# EAGLE design PulsePal_3_0_4 (EAGLE 9.6.2)
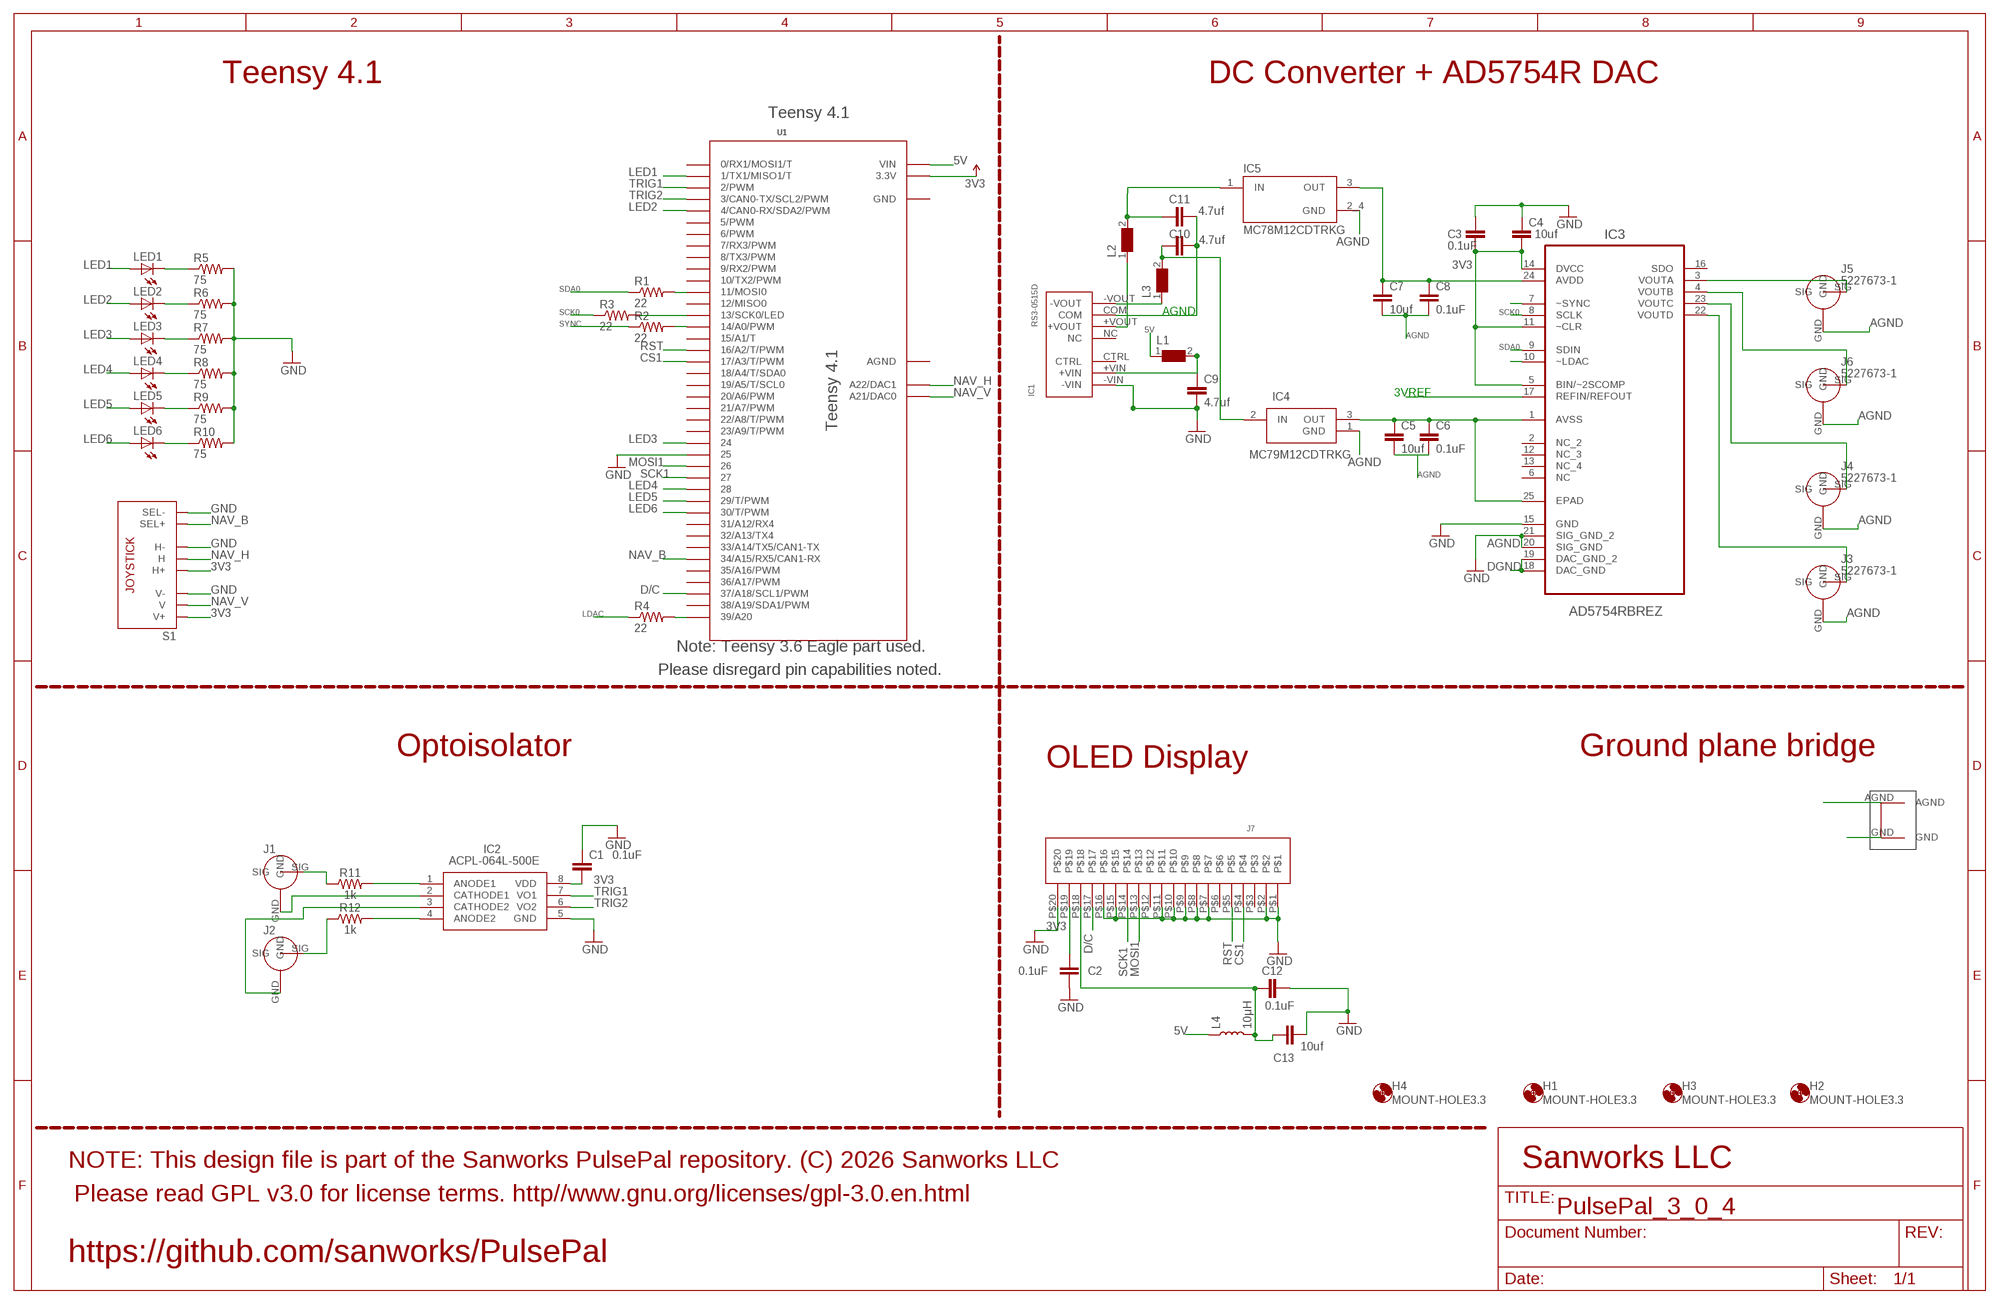
[diagram p0: schematic, sheet 1]

## Parts
C1  0.1uF  1.0UF-0805-25V-10%  [0805]
C2  0.1uF  1.0UF-0805-25V-10%  [0805]
C3  0.1uF  1.0UF-0805-25V-10%  [0805]
C4  10uf  CAP1206  [1206@1]
C5  10uf  CAP1206  [1206@1]
C6  0.1uF  1.0UF-0805-25V-10%  [0805]
C7  10uf  CAP1206  [1206@1]
C8  0.1uF  1.0UF-0805-25V-10%  [0805]
C9  4.7uf  CAP1206  [1206@1]
C10  4.7uf  CAP1206  [1206@1]
C11  4.7uf  CAP1206  [1206@1]
C12  0.1uF  1.0UF-0805-25V-10%  [0805]
C13  10uf  CAP1206  [1206@1]
H1  MOUNT-HOLE3.3  [3,3]
H2  MOUNT-HOLE3.3  [3,3]
H3  MOUNT-HOLE3.3  [3,3]
H4  MOUNT-HOLE3.3  [3,3]
IC1  RS3-0515D  [RS3-0515D]
IC2  ACPL-064L-500E  [SOIC127P599X330-8N]
IC3  AD5754RBREZ  [SOP65P640X120-25N]
IC4  MC79M12CDTRKG  [NVD5117PLT4GVF01]
IC5  MC78M12CDTRKG  [VREG_MC78M12CDTRKG]
J1  5227673-1  [52276731]
J2  5227673-1  [52276731]
J3  5227673-1  [52276731]
J4  5227673-1  [52276731]
J5  5227673-1  [52276731]
J6  5227673-1  [52276731]
J7  NHD-2.7-12864WDW3  [NHD-2.7-12864WDW3]
L1  WE-CBF-742792118_1206  [1206]
L2  WE-CBF-742792118_1206  [1206]
L3  WE-CBF-742792118_1206  [1206]
L4  10μH  2.2μH_SHIELDED_INDUCTOR  [0806]
LED1  LEDCHIPLED_1206  [CHIPLED_1206]
LED2  LEDCHIPLED_1206  [CHIPLED_1206]
LED3  LEDCHIPLED_1206  [CHIPLED_1206]
LED4  LEDCHIPLED_1206  [CHIPLED_1206]
LED5  LEDCHIPLED_1206  [CHIPLED_1206]
LED6  LEDCHIPLED_1206  [CHIPLED_1206]
R1  22  RESISTOR1206  [1206]
R2  22  RESISTOR1206  [1206]
R3  22  RESISTOR1206  [1206]
R4  22  RESISTOR1206  [1206]
R5  75  RESISTOR1206  [1206]
R6  75  RESISTOR1206  [1206]
R7  75  RESISTOR1206  [1206]
R8  75  RESISTOR1206  [1206]
R9  75  RESISTOR1206  [1206]
R10  75  RESISTOR1206  [1206]
R11  1k  10OHM-1206-1/4W-1%  [1206]
R12  1k  10OHM-1206-1/4W-1%  [1206]
S1  JOYSTICKPTH  [JOYSTICK]
U1  TEENSY_3.6_DIL  [TEENSY_3.6_DIL]
U$6  GNDPLANESHRT  [GNDPLANESHRT]

## Nets
3V3: C1.2 C2.1 C3.2 C4.2 IC2.8(VDD) IC3.5(BIN/~2SCOMP) IC3.11(~CLR) IC3.14(DVCC) J7.P$19 S1.H1(H+) S1.V1(V+) U1.3.3V U1.3.3V3(3.3V) ; supply symbol labelled VCC
3VREF: IC3.17(REFIN/REFOUT)
5V: L1.1 L4.1 U1.VIN
AGND: C5.2 C6.2 C7.2 C8.2 C10.1 C11.2 IC1.COM IC3.18(DAC_GND) IC3.19(DAC_GND_2) IC3.20(SIG_GND) IC3.21(SIG_GND_2) IC4.1(GND) IC5.2_4(GND) J3.GND J4.GND J5.GND J6.GND U$6.AGND ; supply symbol labelled GND
CS1: J7.P$4 U1.17/A3(17/A3/T/PWM)
D/C: J7.P$17 U1.37/A18(37/A18/SCL1/PWM)
GND: C1.1 C2.2 C3.1 C4.1 C9.2 C12.2 C13.2 IC1.-VIN IC2.5(GND) IC3.15(GND) J7.P$1 J7.P$2 J7.P$7 J7.P$8 J7.P$9 J7.P$10 J7.P$11 J7.P$15 J7.P$16 J7.P$20 R5.2 R6.2 R7.2 R8.2 R9.2 R10.2 S1.B2A(SEL-) S1.H3(H-) S1.V3(V-) U1.25 U$6.GND
LDAC: IC3.10(~LDAC) R4.1
LED1: LED1.A U1.1(1/TX1/MISO1/T)
LED2: LED2.A U1.4(4/CAN0-RX/SDA2/PWM)
LED3: LED3.A U1.24
LED4: LED4.A U1.28
LED5: LED5.A U1.29(29/T/PWM)
LED6: LED6.A U1.30(30/T/PWM)
MOSI1: J7.P$13 U1.26
N$1: IC2.1(ANODE1) R11.2
N$2: J1.SIG R11.1
N$3: IC2.4(ANODE2) R12.2
N$4: J2.SIG R12.1
N$5: IC2.2(CATHODE1) J1.GND
N$6: IC2.3(CATHODE2) J2.GND
N$7: LED1.C R5.1
N$8: LED2.C R6.1
N$9: IC3.3(VOUTA) J5.SIG
N$10: IC3.4(VOUTB) J6.SIG
N$11: IC3.23(VOUTC) J4.SIG
N$12: IC3.22(VOUTD) J3.SIG
N$13: R1.2 U1.11(11/MOSI0)
N$14: R3.2 U1.13(13/SCK0/LED)
N$15: IC1.-VOUT L3.1
N$16: IC1.+VOUT L2.1
N$17: R2.2 U1.14/A0(14/A0/PWM)
N$18: R4.2 U1.39/A20
N$19: LED3.C R7.1
N$20: LED4.C R8.1
N$21: LED5.C R9.1
N$22: LED6.C R10.1
N$23: C10.2 IC5.1(IN) L2.2
N$24: C11.1 IC4.2(IN) L3.2
N$25: C12.1 C13.1 J7.P$18 L4.2
N$41: C9.1 IC1.+VIN L1.2
NAV_B: S1.B1A(SEL+) U1.34/A15(34/A15/RX5/CAN1-RX)
NAV_H: S1.H2(H) U1.A22(A22/DAC1)
NAV_V: S1.V2(V) U1.A21(A21/DAC0)
RST: J7.P$5 U1.16/A2(16/A2/T/PWM)
SCK0: IC3.8(SCLK) R3.1
SCK1: J7.P$14 U1.27
SDA0: IC3.9(SDIN) R1.1
SYNC: IC3.7(~SYNC) R2.1
TRIG1: IC2.7(VO1) U1.2(2/PWM)
TRIG2: IC2.6(VO2) U1.3(3/CAN0-TX/SCL2/PWM)
VDD: C7.1 C8.1 IC3.24(AVDD) IC5.3(OUT)
VSS: C5.1 C6.1 IC3.1(AVSS) IC3.25(EPAD) IC4.3(OUT)
Unconnected: IC1.CTRL IC1.NC IC3.2(NC_2) IC3.6(NC) IC3.12(NC_3) IC3.13(NC_4) IC3.16(SDO) J7.P$3 J7.P$6 J7.P$12 U1.0(0/RX1/MOSI1/T) U1.5(5/PWM) U1.6(6/PWM) U1.7(7/RX3/PWM) U1.8(8/TX3/PWM) U1.9(9/RX2/PWM) U1.10(10/TX2/PWM) U1.12(12/MISO0) U1.15/A1(15/A1/T) U1.18/A4(18/A4/T/SDA0) U1.19/A5(19/A5/T/SCL0) U1.20/A6(20/A6/PWM) U1.21/A7(21/A7/PWM) U1.22/A8(22/A8/T/PWM) U1.23/A9(23/A9/T/PWM) U1.31/A12(31/A12/RX4) U1.32/A13(32/A13/TX4) U1.33/A14(33/A14/TX5/CAN1-TX) U1.35/A16(35/A16/PWM) U1.36/A17(36/A17/PWM) U1.38/A19(38/A19/SDA1/PWM)

## Notes on the sheet
- Teensy 4.1 | DC Converter + AD5754R DAC
- Teensy 4.1
- SDA0
- SCK0 | AGND | SCK0
- SYNC
- 5V
- AGND
- SDA0
- 3VREF
- Teensy 4.1
- AGND
- AGND
- DGND
- LDAC
- Note: Teensy 3.6 Eagle part used.
- Please disregard pin capabilities noted.
- Optoisolator | Ground plane bridge
- OLED Display
- NOTE: This design file is part of the Sanworks PulsePal repository. (C) 2026 Sanworks LLC | Sanworks LLC
- Please read GPL v3.0 for license terms. http//www.gnu.org/licenses/gpl-3.0.en.html
- https://github.com/sanworks/PulsePal

## Power pins joined to a net without a drawn wire
AGND: U1.AGND
GND: U1.GND U1.GND1(GND)

## Library data of the parts
C1-C3 C6 C8 C12 = SparkFun-Capacitors:1.0UF: 1µF ceramic capacitors A capacitor is a passive two-terminal electrical component used to store electrical energy temporarily in an electric field.; PROD_ID: CAP-08064; VALUE: 1.0uF
C4 C5 C7 C9-C11 C13 = SparkFun-Capacitors:CAP: Capacitor Standard 0603 ceramic capacitor, and 0.1" leaded capacitor.
H1-H4 = holes:MOUNT-HOLE: MOUNTING HOLE with drill center marker
IC1 = JoshParts10:RS3-0515D
IC2 = ACPL-064L-500E:ACPL-064L-500E: BROADCOM LIMITED - ACPL-064L-500E - Optocoupler, Digital Output, 2 Channel, 3.75 kV, 10 Mbaud, SOIC, 8 Pins Source: Datasheet <https://componentsearchengine.com/Datasheets/2/ACPL-064L-500E.pdf>; DESCRIPTION: BROADCOM LIMITED - ACPL-064L-500E - Optocoupler, Digital Output, 2 Channel, 3.75 kV, 10 Mbaud, SOIC, 8 Pins; HEIGHT: 3.302mm; MANUFACTURER_NAME: Avago Technologies; MANUFACTURER_PART_NUMBER: ACPL-064L-500E; MOUSER_PART_NUMBER: 630-ACPL-064L-500E; MOUSER_PRICE-STOCK: https://www.mouser.co.uk/ProductDetail/Broadcom-Avago/ACPL-064L-500E?qs=zXUFZjqEZijW%2FjwN8Fr74w%3D%3D
IC3 = Analog Devices_By_element14_Batch_1:AD5754RBREZ: DAC; MPN: AD5754RBREZ; OC_FARNELL: 1786050; OC_NEWARK: 51P3755; PACKAGE: TSSOP-24; SUPPLIER: Analog Devices
IC4 = MC79M12CDTRKG:MC79M12CDTRKG: No External Components Required; Internal Thermal Overload Protection; Internal Short Circuit Current Limiting; Output Transistor Safe-Area Compensation; Also Available in Surface Mount DPAK (DT) Package DEVICE TYPE/NOMINAL OUTPUT VOLTAGE MC79M05 -5.0 V MC79M12 -12 V MC79M08 -8.0 V MC79M15 -15 V; Pb-Free Package May be Available. The G-Suffix Denotes a Source: Datasheet <https://www.onsemi.com/pub/Collateral/MC79M00-D.PDF>; DESCRIPTION: No External Components Required; Internal Thermal Overload Protection; Internal Short Circuit Current Limiting; Output Transistor Safe-Area Compensation; Also Available in Surface Mount DPAK (DT) Package DEVICE TYPE/NOMINAL OUTPUT VOLTAGE MC79M05 -5.0 V MC79M12 -12 V MC79M08 -8.0 V MC79M15 -15 V; Pb-Free Package May be Available. The G-Suffix Denotes a; HEIGHT: mm; MANUFACTURER_NAME: onsemi; MANUFACTURER_PART_NUMBER: MC79M12CDTRKG; MOUSER_PART_NUMBER: 863-MC79M12CDTRKG; MOUSER_PRICE-STOCK: https://www.mouser.co.uk/ProductDetail/onsemi/MC79M12CDTRKG?qs=%252B9%2Fcbd0IE0QhvXhOplakjg%3D%3D
IC5 = MC78M12CDTRKG:MC78M12CDTRKG; MANUFACTURER: ON Semiconductor; MAXIMUM_PACKAGE_HEIGHT: 2.38 mm; PARTREV: 29; STANDARD: Manufacturer Recommendations
J1-J6 = 5227673-1:5227673-1: Body Features: Body Plating Material Nickel | Body Material Zinc | Configuration Features: PCB Mount Orientation Vertical | Number of Positions 1 | Number of Coaxial Contacts 1 | Contact Features: RF Connector Center Contact Plating Material Gold | RF Connector Center Contact Material Phosphor Bronze | RF Connector Center Contact Plating Thickness 889 MICIN | RF Connector Center Contact Underplating Material Nickel | Dimensions: Mounting Post Length 3.48 MM | Mounting Post Length .137 INCH | Profile Height Source: Datasheet <https://www.te.com/commerce/DocumentDelivery/DDEController?Action=srchrtrv&DocNm=1307191_BNC_Connectors&DocType=Catalog Section&DocLang=English&PartCntxt=5227673-1&DocFormat=pdf>; DESCRIPTION: Body Features: Body Plating Material Nickel | Body Material Zinc | Configuration Features: PCB Mount Orientation Vertical | Number of Positions 1 | Number of Coaxial Contacts 1 | Contact Features: RF Connector Center Contact Plating Material Gold | RF Connector Center Contact Material Phosphor Bronze | RF Connector Center Contact Plating Thickness 889 MICIN | RF Connector Center Contact Underplating Material Nickel | Dimensions: Mounting Post Length 3.48 MM | Mounting Post Length .137 INCH | Profile Height; HEIGHT: 34mm; MANUFACTURER_NAME: TE Connectivity; MANUFACTURER_PART_NUMBER: 5227673-1; MOUSER_PART_NUMBER: 571-5227673-1; MOUSER_PRICE-STOCK: https://www.mouser.co.uk/ProductDetail/TE-Connectivity/5227673-1?qs=GSeC4G%252BEqEWRusayo0jRGQ%3D%3D
J7 = JoshParts10:NHD-2.7-12864WDW3
L1-L3 = WE-CBF:WE-CBF: SMD EMI Suppression Ferrite Beads WE-CBF - Excellent anti-EMI properties - Low DC-restistance - Impedances till 3000 ohms - Rated current up to 6 A -- Reliable Ni-Sn electrodes -- Perfect as data lined filter and for uncoupling of distribution voltage; MPN: 742792118; OC_FARNELL: 1800374; OC_NEWARK: 78R5648; PACKAGE: IND-1206; SUPPLIER: Wuerth Elektronik
L4 = SparkFun-Coils:2.2μH_SHIELDED_INDUCTOR: Murata 2.2uH Inductor 2.2uH 1.2A 110mOhm 0806 Package Shielded Bourns 2.2uH Inductor 2.2uH 5.5A 205mOhm 5x5mm Package Shielded; PROD_ID: NDUC-14257
LED1-LED6 = led:LED: LED OSRAM: - CHIPLED LG R971, LG N971, LY N971, LG Q971, LY Q971, LO R971, LY R971 LH N974, LH R974 LS Q976, LO Q976, LY Q976 LO Q996 - Hyper CHIPLED LW Q18S LB Q993, LB Q99A, LB R99A - SideLED LS A670, LO A670, LY A670, LG A670, LP A670 LB A673, LV A673, LT A673, LW A673 LH A674 LY A675 LS A676, LA A676, LO A676, LY A676, LW A676 LS A679, LY A679, LG A679 - Hyper Micro SIDELED® LS Y876, LA Y876, LO Y876, LY Y876 LT Y87S - SmartLED LW L88C, LW L88S LB L89C, LB L89S, LG L890 LS L89K, LO L89K, LY L89K LS L896, LA L896, LO L896, LY L896 - TOPLED LS T670, LO T670, LY T670, LG T670, LP T670 LSG T670, LSP T670, LSY T670, LOP T670, LYG T670 LG T671, LOG T671, LSG T671 LB T673, LV T673, LT T673, LW T673 LH T674 LS T676, LA T676, LO T676, LY T676, LB T676, LH T676, LSB T676, LW T676 LB T67C, LV T67C, LT T67C, LS T67K, LO T67K, LY T67K, LW E67C LS E67B, LA E67B, LO E67B, LY E67B, LB E67C, LV E67C, LT E67C LW T67C LS T679, LY T679, LG T679 LS T770, LO T770, LY T770, LG T770, LP T770 LB T773, LV T773, LT T773, LW T773 LH T774 LS E675, LA E675, LY E675, LS T675 LS T776, LA T776, LO T776, LY T776, LB T776 LHGB T686 LT T68C, LB T68C - Hyper Mini TOPLED® LB M676 - Mini TOPLED Santana® LG M470 LS M47K, LO M47K, LY M47K Source: http://www.osram.convergy.de LUXEON: - LUMILED® LXK2-PW12-R00, LXK2-PW12-S00, LXK2-PW14-U00, LXK2-PW14-V00 LXK2-PM12-R00, LXK2-PM12-S00, LXK2-PM14-U00 LXK2-PE12-Q00, LXK2-PE12-R00, LXK2-PE12-S00, LXK2-PE14-T00, LXK2-PE14-U00 LXK2-PB12-K00, LXK2-PB12-L00, LXK2-PB12-M00, LXK2-PB14-N00, LXK2-PB14-P00, LXK2-PB14-Q00 LXK2-PR12-L00, LXK2-PR12-M00, LXK2-PR14-Q00, LXK2-PR14-R00 LXK2-PD12-Q00, LXK2-PD12-R00, LXK2-PD12-S00 LXK2-PH12-R00, LXK2-PH12-S00 LXK2-PL12-P00, LXK2-PL12-Q00, LXK2-PL12-R00 Source: www.luxeon.com KINGBRIGHT: KA-3528ASYC Source: www.kingbright.com
R1-R4 = SparkFun-Resistors:RESISTOR: Generic Resistor Package
R5-R10 = SparkFun:RESISTOR: Resistor Basic schematic elements and footprints for 0603, 1206, and PTH resistors.
R11 R12 = SparkFun-Resistors:10OHM: 10Ω resistor A resistor is a passive two-terminal electrical component that implements electrical resistance as a circuit element. Resistors act to reduce current flow, and, at the same time, act to lower voltage levels within circuits. - Wikipedia; PROD_ID: RES-08705; VALUE: 10
S1 = SparkFun:JOYSTICK: Thumb Joystick Joystick commonly found in PS2 controllers. Two pots and a select switch. Footprint proven. Spark Fun Electronics SKU : COM-09032
U1 = Teensy_3_and_LC_Series_Boards_v1.4:TEENSY_3.6_DIL: Teensy 3.6 DIL Package
U$6 = Joshparts2:GNDPLANESHRT

## Net classes
0 default: width 0.203 mm

## Board
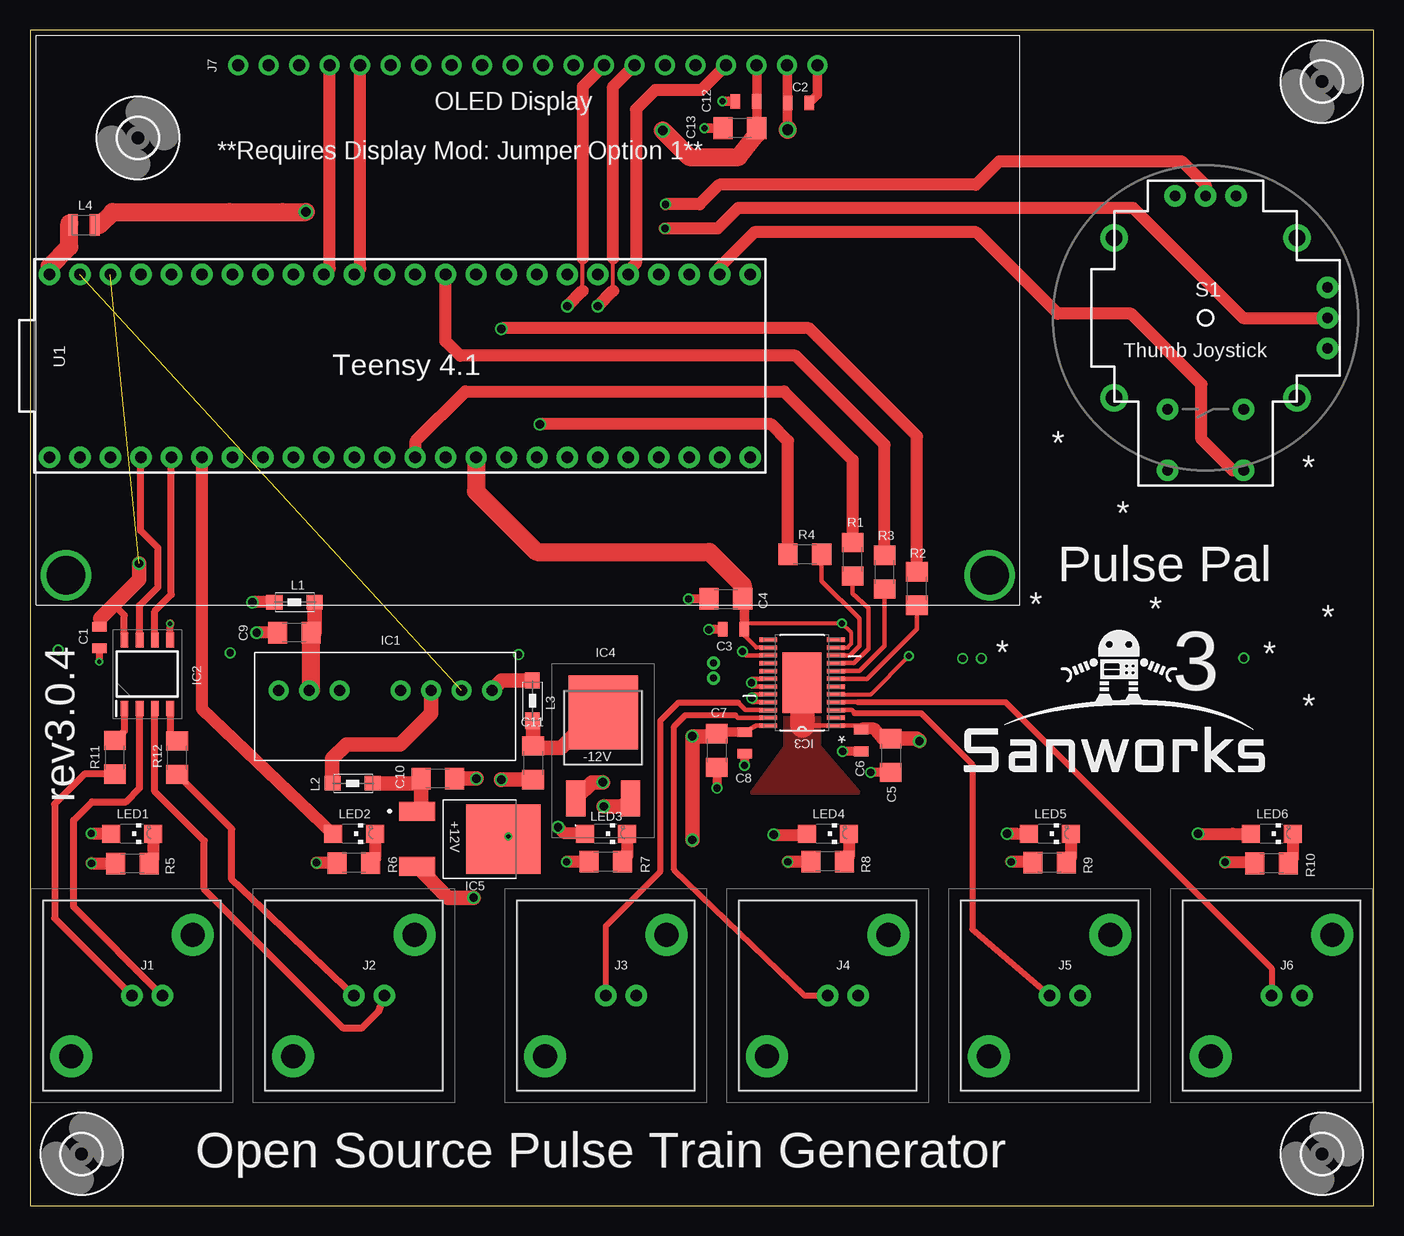
[diagram p1: board, top side]
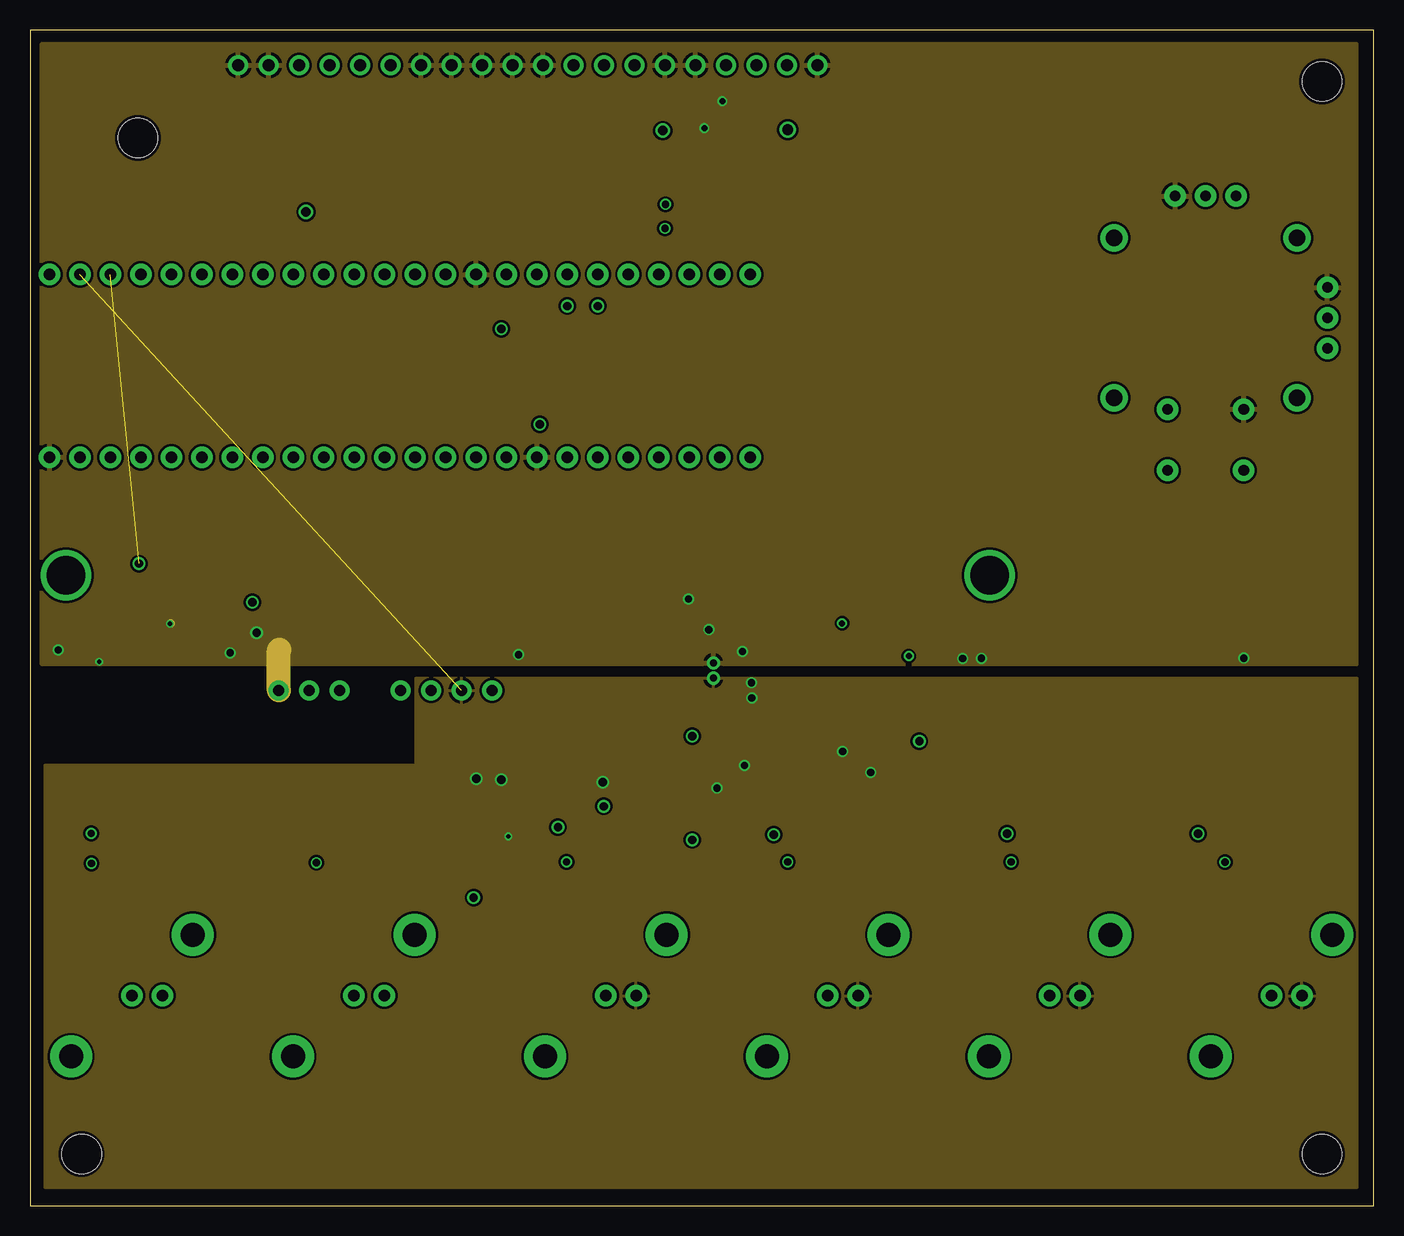
[diagram p2: board, inner layer Route2]
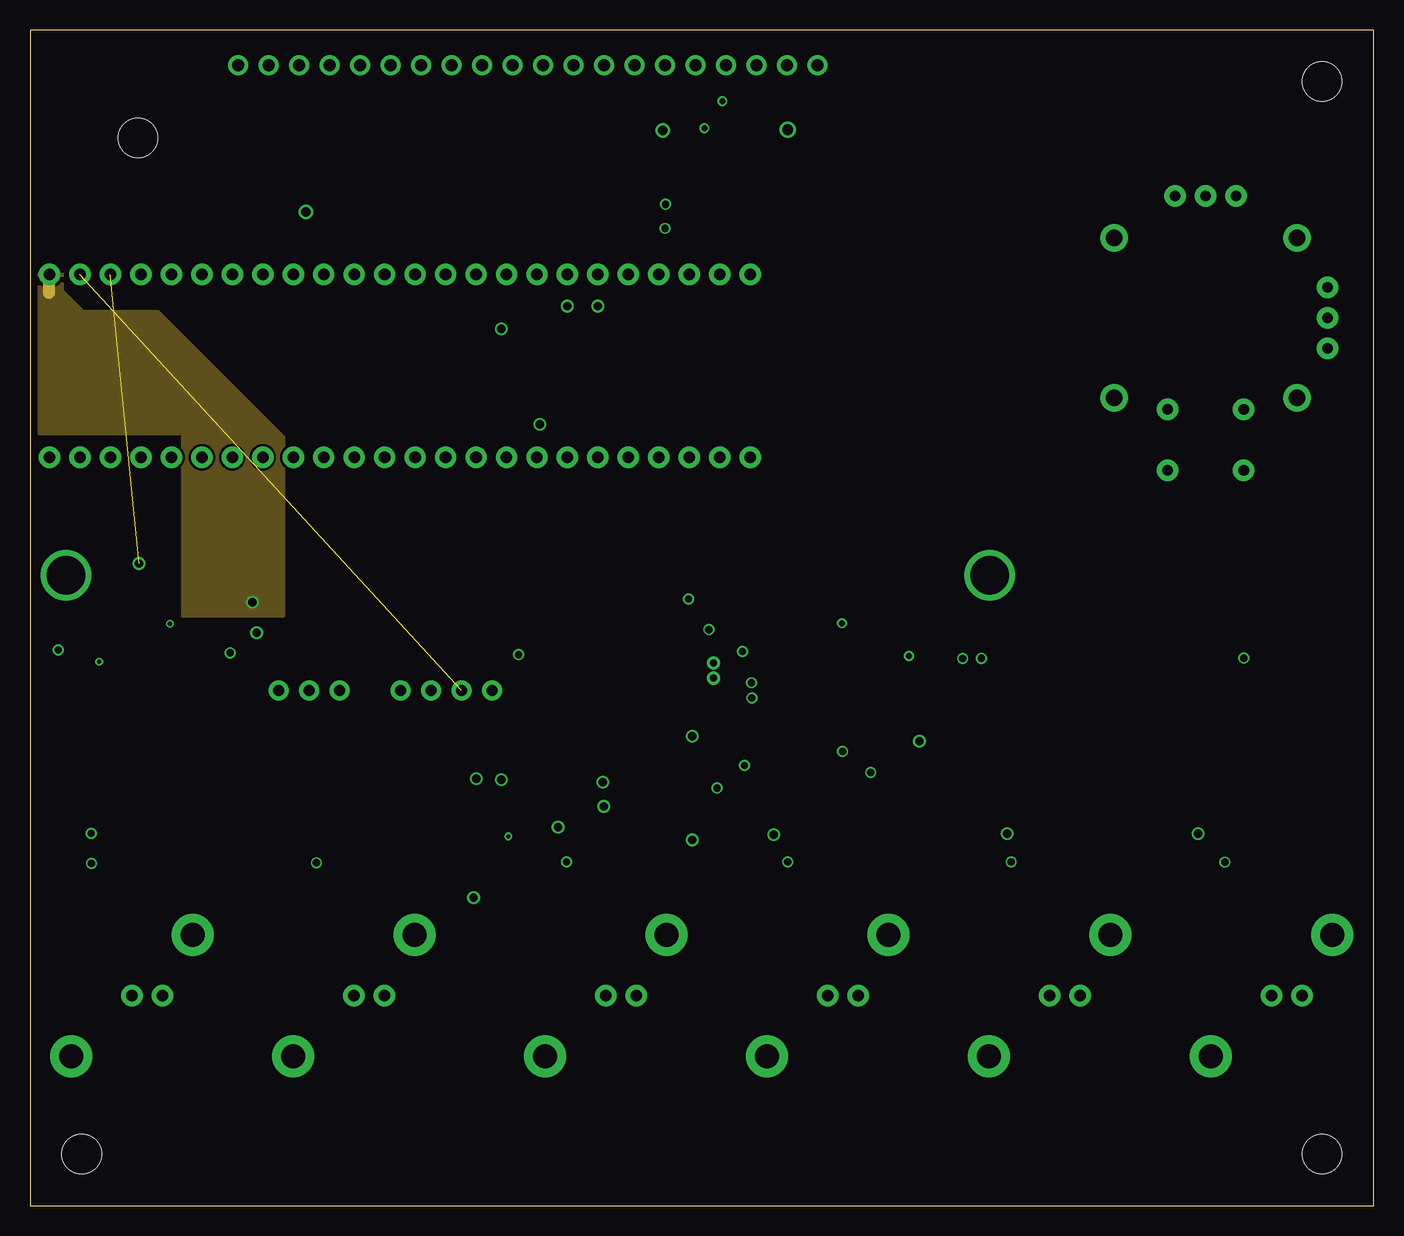
[diagram p3: board, inner layer Route15]
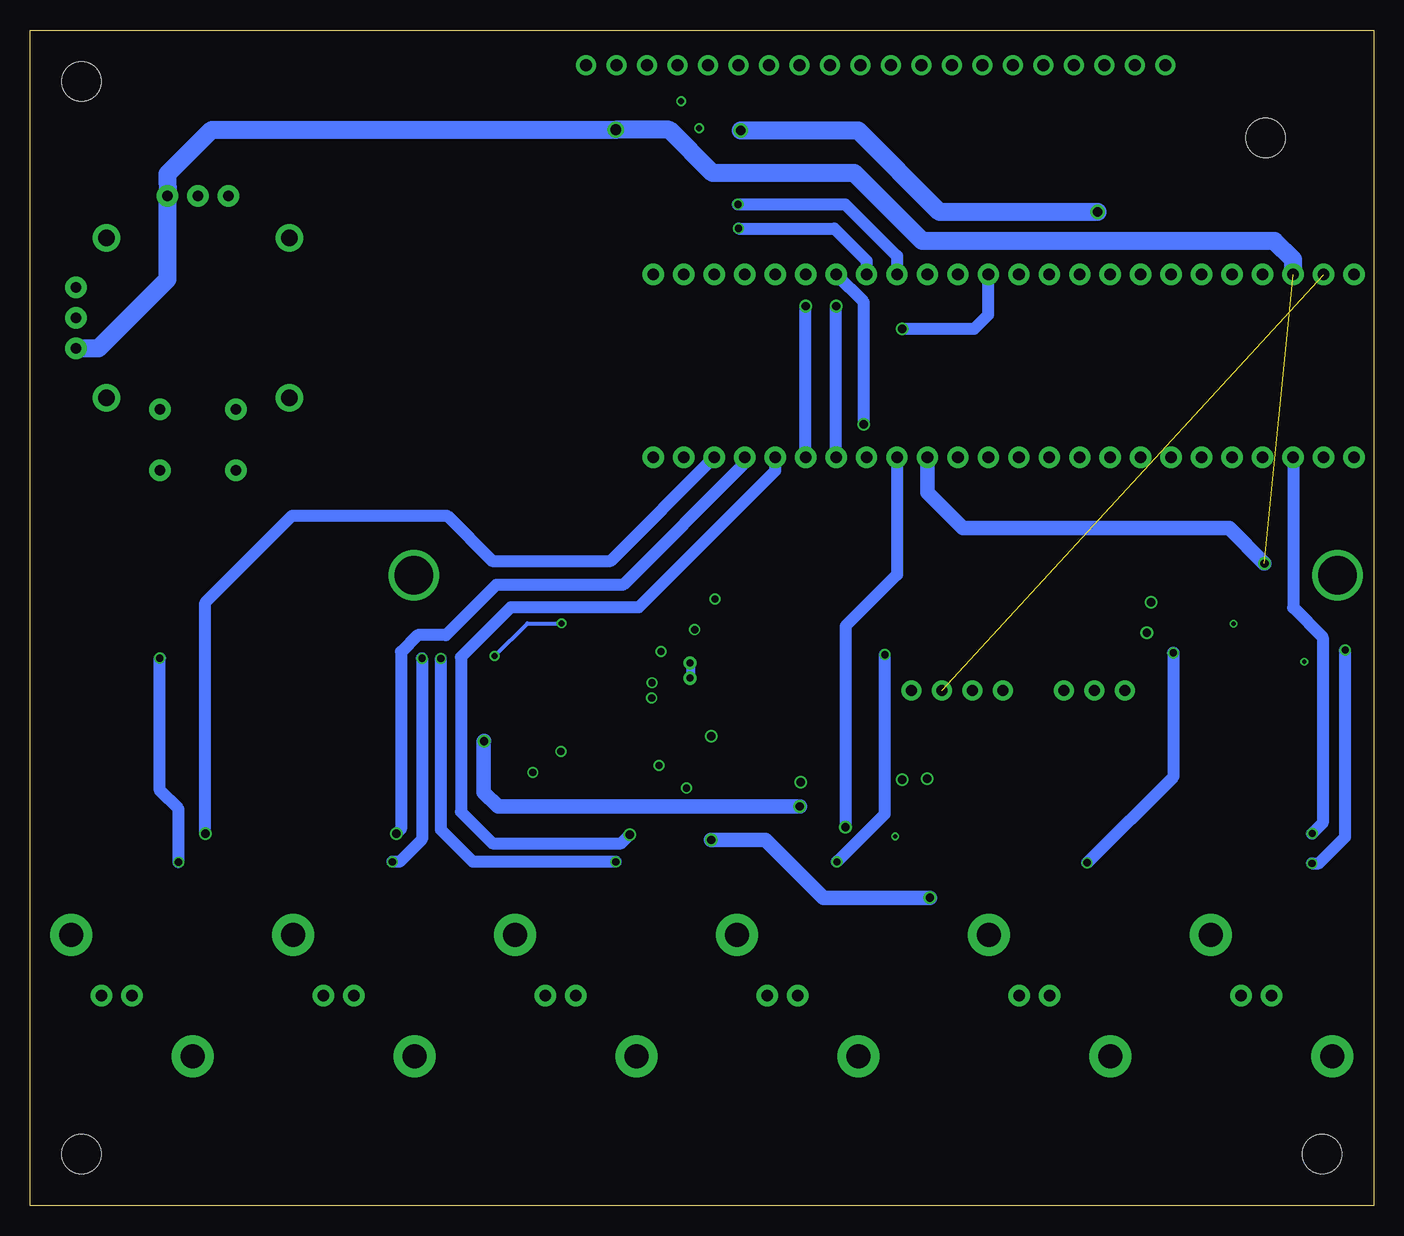
[diagram p4: board, bottom side, seen from below]

Size 112 x 98 mm. Coordinates in mm from the lower left corner, seen from the top.
Outline: 112,98 0,98 0,0 112,0 112,98
Copper layers (1+2*15+16): Top 0.035mm / dielectric 1.5mm / Route2 0.0175mm / dielectric 1.1mm / Route15 0.0175mm / dielectric 0.2mm / Bottom 0.035mm
Design rules "SeeedStudio_2layer_DRU_no_angle_20140221 *": minimum track width 6mil, minimum drill 12mil, track to track 8mil, track to pad 8mil, pad to pad 8mil, via to via 8mil, smd to smd 0mil, copper to edge 10mil, drill to drill 10mil, minimum pad ring 10mil, minimum via ring 6mil, stop-mask expansion 2mil, vias tented up to drill 100mil, thermal gap 10mil

### Footprints (pad centres in the part's own frame; a part is rotated, then mirrored left to right if it is on the bottom)
0805 = smd 0.8 x 1.2: 1 -0.9,0; 2 0.9,0
1206@1 = smd 1.6 x 1.8: 1 -1.4,0; 2 1.4,0
3,3 = hole 3.3: 0,0
RS3-0515D = drill 0.9 pad 1.676: +VIN 7.62,5.08; +VOUT 17.78,5.08; -VIN 5.08,5.08; -VOUT 22.86,5.08; COM 20.32,5.08; CTRL 10.16,5.08; NC 15.24,5.08
SOIC127P599X330-8N = smd 1.25 x 0.65: 1 -2.85,1.905; 2 -2.85,0.635; 3 -2.85,-0.635; 4 -2.85,-1.905; 5 2.85,-1.905; 6 2.85,-0.635; 7 2.85,0.635; 8 2.85,1.905
SOP65P640X120-25N = smd 1.473 x 0.356: 1 -2.819,3.581; 2 -2.819,2.921; 3 -2.819,2.286; 4 -2.819,1.626; 5 -2.819,0.965; 6 -2.819,0.33; 7 -2.819,-0.33; 8 -2.819,-0.965; 9 -2.819,-1.626; 10 -2.819,-2.286; 11 -2.819,-2.921; 12 -2.819,-3.581; 13 2.819,-3.581; 14 2.819,-2.921; 15 2.819,-2.286; 16 2.819,-1.626; 17 2.819,-0.965; 18 2.819,-0.33; 19 2.819,0.33; 20 2.819,0.965; 21 2.819,1.626; 22 2.819,2.286; 23 2.819,2.921; 24 2.819,3.581 | smd 3.251 x 5.029: 25 0,0
NVD5117PLT4GVF01 = smd 3 x 1.6: 1 8.95,-2.285; 3 8.95,2.285 | smd 6.2 x 5.8: 2 1.77,0
VREG_MC78M12CDTRKG = smd 3 x 1.6: 1 -4.39,2.29; 3 -4.39,-2.29 | smd 6.2 x 5.8: 2_4 2.79,0
52276731 = drill 0.97 pad 1.778: GND 2.54,0; SIG 0,0 | drill 2 pad 3.5: POST1 -5.08,-5.08; POST2 5.08,5.08
NHD-2.7-12864WDW3 = drill 3.2 pad 4: HOLE1 2.5,2.5; HOLE2 79.5,2.5 | drill 1 pad 1.676: P$1 16.87,45; P$2 19.41,45; P$3 21.95,45; P$4 24.49,45; P$5 27.03,45; P$6 29.57,45; P$7 32.11,45; P$8 34.65,45; P$9 37.19,45; P$10 39.73,45; P$11 42.27,45; P$12 44.81,45; P$13 47.35,45; P$14 49.89,45; P$15 52.43,45; P$16 54.97,45; P$17 57.51,45; P$18 60.05,45; P$19 62.59,45; P$20 65.13,45
1206 = smd 1.35 x 1.2: 1 -1.675,0; 2 1.675,0
0806 = smd 0.8 x 1.8: 1 -0.9,0; 2 0.9,0
CHIPLED_1206 = smd 1.5 x 1.5: A 0,-1.75; C 0,1.75
1206' = smd 1.6 x 1.8: 1 -1.4,0; 2 1.4,0
JOYSTICK = drill 0.9 pad 1.778: B1A -3.175,12.7; B1B 3.175,12.7; B2A -3.175,7.62; B2B 3.175,7.62 | drill 0.889 pad 1.778: H1 -2.54,-10.16; H2 0,-10.16; H3 2.54,-10.16; V1 -10.16,2.54; V2 -10.16,0; V3 -10.16,-2.54 | drill 1.397 pad 2.286: MOUNT1 -7.62,6.668; MOUNT2 -7.62,-6.668; MOUNT3 7.62,-6.668; MOUNT4 7.62,6.668
TEENSY_3.6_DIL = drill 0.965 pad 1.778: 0 -7.62,25.4; 1 -7.62,22.86; 2 -7.62,20.32; 3 -7.62,17.78; 3.3V 7.62,22.86; 3.3V3 -7.62,-7.62; 4 -7.62,15.24; 5 -7.62,12.7; 6 -7.62,10.16; 7 -7.62,7.62; 8 -7.62,5.08; 9 -7.62,2.54; 10 -7.62,0; 11 -7.62,-2.54; 12 -7.62,-5.08; 13 7.62,-5.08; 14/A0 7.62,-2.54; 15/A1 7.62,0; 16/A2 7.62,2.54; 17/A3 7.62,5.08; 18/A4 7.62,7.62; 19/A5 7.62,10.16; 20/A6 7.62,12.7; 21/A7 7.62,15.24; 22/A8 7.62,17.78; 23/A9 7.62,20.32; 24 -7.62,-10.16; 25 -7.62,-12.7; 26 -7.62,-15.24; 27 -7.62,-17.78; 28 -7.62,-20.32; 29 -7.62,-22.86; 30 -7.62,-25.4; 31/A12 -7.62,-27.94; 32/A13 -7.62,-30.48; 33/A14 7.62,-30.48; 34/A15 7.62,-27.94; 35/A16 7.62,-25.4; 36/A17 7.62,-22.86; 37/A18 7.62,-20.32; 38/A19 7.62,-17.78; 39/A20 7.62,-15.24; A21 7.62,-12.7; A22 7.62,-10.16; AGND 7.62,25.4; GND -7.62,27.94; GND1 7.62,-7.62; VIN 7.62,27.94
GNDPLANESHRT = drill 0.6: AGND -1.27,0; GND 0,0

### Placement (x,y rotation side)
C1  5.79,47.35 90 top
C2  64.06,91.92 0 top
C3  58.65,48.03 0 top
C4  58.01,50.57 0 top
C5  71.76,37.51 270 top
C6  69.29,38.75 270 top
C7  57.24,37.93 270 top
C8  59.58,38.56 270 top
C9  22.05,47.75 180 top
C10  33.99,35.58 180 top
C11  41.94,36.91 270 top
C12  59.69,92.05 180 top
C13  59.18,89.81 180 top
H1  9,89 180 top
H2  107.7,93.7 180 top
H3  107.7,4.3 180 top
H4  4.3,4.3 180 top
IC1  15.65,37.86 0 top
IC2  9.78,44.3 90 top
IC3  64.36,43.59 180 top
IC4  47.78,42.88 270 top
IC5  36.65,30.56 0 top
J1  8.5,17.5 0 top
J2  27,17.5 0 top
J3  48,17.5 0 top
J4  66.5,17.5 0 top
J5  85,17.5 0 top
J6  103.5,17.5 0 top
J7  0.5,50.05 0 top
L1  22.05,50.29 0 top
L2  26.89,35.19 0 top
L3  41.89,42.08 270 top
L4  4.5,81.74 0 top
LED1  8.5,31 270 top
LED2  27,31 270 top
LED3  48,31 270 top
LED4  66.5,31 270 top
LED5  85,31 270 top
LED6  103.5,31 270 top
R1  22  [1206']  68.58,53.87 90 top
R2  22  [1206']  73.94,51.44 90 top
R3  22  [1206']  71.25,52.81 90 top
R4  22  [1206']  64.59,54.28 180 top
R5  75  [1206']  8.54,28.5 180 top
R6  75  [1206']  27,28.55 180 top
R7  75  [1206']  48,28.65 180 top
R8  75  [1206']  66.5,28.68 180 top
R9  75  [1206']  85,28.57 180 top
R10  75  [1206']  103.5,28.52 180 top
R11  1k  [1206']  7.09,37.36 90 top
R12  1k  [1206']  12.27,37.34 90 top
S1  98,74 180 top
U1  29.57,70 90 top
U$2  [SANWORKS_LOGO]  77.6,35.94 0 top
U$6  56.97,45.24 90 top

### Tracks (layer width: path | path; a pad name or v marks a point on that pad's centre or on a via)
3V3  (via drill 0.5, 0.7, 0.9)  (1 unrouted)
  Top 0.35: IC3.14 60.55,46.51 59.55,47.51 C3.2 | IC3.5 70.1,42.62 73.28,45.8 v73.27,45.81 | 59.55,48.54 v67.69,48.54 68.48,47.75 68.48,46.84 68.15,46.51 IC3.11
  Top 0.6: 6.53,49.64 5.79,48.91 C1.2 | IC2.8 7.87,49.23 7.01,50.09
  Top 0.8: 5.87,48.95 5.87,48.32 C1.2 | C3.2 59.55,48.54 59.55,50.48 59.44,50.59 | 63.16,89.7 C2.1 63.16,94.98 J7.P$19
  Top 1.2: v9.09,53.52 9.09,52.17 7.01,50.09 5.87,48.95
  Top 1.5: U1.3.3V3 37.19,59.54 42.24,54.48 56.64,54.48 59.44,51.69 59.44,50.59 C4.2 | v63.17,89.69 63.16,89.7
  Bottom 0.35: v73.27,45.81 70.54,48.54 v67.69,48.54
  Bottom 1.2: U1.3.3V3 37.19,59.44 34.21,56.46 12.04,56.46 v9.09,53.52
  Bottom 1.5: S1.V1 106.29,71.46 100.53,77.22 S1.H1 100.56,85.98 96.85,89.69 v63.17,89.69 58.7,89.69 55.09,86.08 43.28,86.08 37.62,80.42 8.26,80.42 6.71,78.87 U1.3.3V
5V  (via drill 0.7)
  Top 0.8: 3.28,81.86 3.28,81.42 L4.1
  Top 1: L1.1 v18.54,50.29
  Top 1.5: U1.VIN 1.63,78.28 3.28,79.93 3.28,81.86
  Route15 1: 1.57,77.62 1.57,76.1
  pour Route15: 0.79,78.13 0.79,64.39 12.73,64.39 12.73,49.2 21.16,49.2 21.16,64.01 10.69,74.47 4.45,74.47 2.69,76.23 2.69,78.13
AGND  (via drill 0.35, 0.6, 0.7)  (1 unrouted)
  Top 0.381: v60.17,42.32 60.17,42.62 IC3.20 60.2,42.62 60.2,41.96 IC3.21 | IC3.19 60.15,43.26 v60.15,43.59 60.15,43.92 IC3.18
  Top 0.762: C5.2 70.77,36.11 v70.08,36.09 | C6.2 v67.75,37.85 v67.74,37.85 | C8.2 59.56,36.83 v59.56,36.68 | C7.2 57.28,36.5 v57.28,34.8
  Top 1.2: C10.1 37.24,35.59 v37.22,35.6 | C11.2 v39.27,35.51 v39.28,35.5 | IC4.1 46.85,35.28 v47.75,35.28 | IC5.2_4 39.67,30.56 v39.88,30.76
  Bottom 0.381: v60.15,43.59 60.12,43.59
  pour Route2: 32.16,44.02 110.64,44.02 110.64,1.45 1.24,1.45 1.24,36.75 32.16,36.75
CS1
  Top 1: J7.P$4 24.99,78.12 U1.17/A3
D/C
  Top 1: U1.37/A18 49.89,77.92 50.52,78.56 50.52,91.39 52.12,92.99 55.95,92.99 J7.P$17
GND  (via drill 0.35, 0.5, 0.6, 0.7)
  Top 0.356: IC3.15 59.69,45.87 v59.38,46.18
  Top 0.6: IC2.5 11.68,48.49 | v5.77,45.34 5.79,45.37 C1.1
  Top 0.7: 11.68,48.49 v11.67,48.5
  Top 0.762: C3.1 56.62,48.03 v56.59,48.01 | C4.1 v54.89,50.57
  Top 0.8: C2.2 65.63,92.59 J7.P$20 | C12.2 58.78,92.06 v57.72,92.06 | C13.2 v56.21,89.81
  Top 1: C9.2 v18.9,47.75 | R10.2 102.02,28.6 99.64,28.6 v99.62,28.63 | R9.2 83.52,28.65 v81.79,28.65 | R8.2 65.05,28.63 63.2,28.63 v63.17,28.65 | 25.57,28.57 R6.2 23.9,28.55 v23.88,28.57 | v5.13,28.52 5.16,28.5 R5.2 | R7.2 v44.73,28.65
  Route2 0.7: v11.67,48.5 11.71,48.54
  Route2 2: IC1.-VIN 20.73,46.28 20.78,46.33
  Bottom 0.762: 56.95,43.89 56.95,45.21 U$6.GND
  Bottom 1: v44.73,28.65 40.74,32.64 v40.74,45.92 | v23.88,28.57 16.66,35.79 16.66,46.08 v16.69,46.08 | v5.13,28.52 4.55,28.52 2.36,30.71 v2.36,46.3 | v79.32,45.62 79.32,30.53 81.2,28.65 v81.79,28.65 | v101.18,45.63 101.17,45.62 101.17,34.59 99.62,33.05 v99.62,28.63 | v63.17,28.65 75.08,28.65 77.75,31.32 v77.75,45.59
  pour Route2: 110.57,45.17 110.57,96.78 0.99,96.81 0.99,45.17
LDAC
  Top 0.356: 68.35,45.87 IC3.10
  Top 0.381: R4.1 65.99,52.06 69.16,48.94 69.16,46.63 68.35,45.87
LED1  (via drill 0.6)
  Top 1: v5.11,31.01 6.74,31.01 LED1.A
  Bottom 1: U1.1 6.71,49.84 4.24,47.37 4.24,31.88 v5.11,31.01
LED2
  Top 1: U1.4 14.33,41.42 LED2.A
LED3  (via drill 0.7)
  Top 1: LED3.A 46.27,31 46.31,31.04 44.53,31.04 v44.02,31.55
  Bottom 1: U1.24 39.73,52.6 44.02,48.31 v44.02,31.55
LED4  (via drill 0.7)
  Top 1: v62,30.91 64.16,30.91 LED4.A
  Bottom 1: U1.28 49.89,61.24 61.26,49.86 71.93,49.86 76.07,45.72 76.07,32.82 73.46,30.2 62.71,30.2 v62,30.91
LED5  (via drill 0.7)
  Top 1: v81.46,31.01 82.24,31.01 LED5.A
  Bottom 1: U1.29 52.43,61.9 62.58,51.74 73.13,51.74 77.32,47.55 79.68,47.55 81.08,46.15 81.08,31.39 v81.46,31.01
LED6  (via drill 0.7)
  Top 1: v97.38,30.99 100.24,30.99 LED6.A
  Bottom 1: U1.30 63.6,53.75 73.48,53.75 77.24,57.51 90.14,57.51 97.38,50.27 v97.38,30.99
MOSI1  (via drill 0.7)
  Top 0.35: 46.08,76.25 46.08,78.92
  Top 0.4: 46.08,78.92 46.1,78.94
  Top 1: v44.81,74.98 46.08,76.25 | J7.P$13 46.1,93.3 46.1,78.94
  Bottom 1: U1.26 v44.81,74.98
N$1
  Top 0.6: IC2.1 7.87,39.55 R11.2
N$2
  Top 0.6: R11.1 4.55,35.96 2.06,33.47 2.06,23.94 J1.SIG
N$3
  Top 0.6: IC2.4 11.68,39.32 R12.2
N$4
  Top 0.6: J2.SIG 16.82,27.18 16.82,31.39 R12.1
N$5
  Top 0.6: J1.GND 3.63,24.91 3.63,32.11 5.18,33.66 8,33.66 9.14,34.8 IC2.2
N$6
  Top 0.6: J2.GND 29.04,16.16 27.66,14.78 26.11,14.78 14.53,26.36 14.53,30.4 10.41,34.52 IC2.3
N$7
  Top 1: LED1.C 10.25,28.8 R5.1
N$8
  Top 1: R6.1 28.71,28.86 28.75,29.02 LED2.C
N$9
  Top 0.356: IC3.3 68.5,41.3
  Top 0.381: 68.5,41.3 68.76,41.05
  Top 0.5: 68.76,41.05 74.27,41.05 78.56,36.75 78.56,23.03 84.97,17.53 J5.SIG
N$10
  Top 0.381: 69.04,41.96 IC3.4
  Top 0.5: 69.04,41.96 81.33,41.96 103.5,19.79 J6.SIG
N$11
  Top 0.381: IC3.23 59,40.66 58.78,40.89
  Top 0.5: J4.SIG 64.6,17.5 53.7,28 53.7,39.95 54.63,40.89 58.78,40.89
N$12
  Top 0.356: IC3.22 59.66,41.3
  Top 0.381: 59.03,41.94 59.66,41.3
  Top 0.5: J3.SIG 48,23.31 52.55,27.86 52.55,40.44 54.05,41.94 59.03,41.94
N$13
  Top 1: U1.11 32.11,63.68 36.3,67.87 62.86,67.87 68.58,62.15 R1.2
N$14
  Top 1: R3.2 71.25,63.42 63.83,70.84 35.87,70.84 34.65,72.06 U1.13
N$15
  Top 1.2: IC1.-VOUT 39.33,43.76 L3.1
N$16
  Top 1.2: IC1.+VOUT 33.43,41.02 30.86,38.46 26.39,38.46 25.2,37.26 25.2,35.21 L2.1
N$17  (via drill 0.7)
  Top 1: R2.2 73.94,64.14 64.95,73.13 39.37,73.13 39.32,73.08 v39.31,73.09
  Bottom 1: v39.31,73.09 33.29,73.09 32.11,74.27 U1.14/A0
N$18  (via drill 0.7)
  Top 1: R4.2 63.19,63.73 61.8,65.13 v42.49,65.13
  Bottom 1: v42.49,65.13 42.49,75.31 U1.39/A20
N$19
  Top 1: LED3.C 49.75,29 R7.1
N$20
  Top 1: LED4.C 68.25,29.11 68.22,29 R8.1
N$21
  Top 1: R9.1 86.75,28.93 LED5.C
N$22
  Top 1: R10.1 105.25,28.87 LED6.C
N$23
  Top 1.2: L2.2 28.58,35.18 32.19,35.18 C10.2 32.59,33.18 IC5.1
N$24
  Top 1.2: L3.2 41.94,40.36 C11.1 42.11,38.13 44.27,38.13 47.24,41.1 IC4.2
N$25  (via drill 0.8)
  Top 0.8: C13.1 60.59,89.82 C12.1 60.59,95.01 J7.P$18 | L4.2 5.77,81.74
  Top 1.5: v52.76,89.61 54.97,87.4 59.08,87.4 60.58,89.33 C13.1 | 5.77,81.74 5.79,81.74 6.88,82.83 16.64,82.83 21.03,82.83 v23.01,82.83
  Bottom 1.5: v23.01,82.83 36.17,82.83 42.95,89.61 v52.76,89.61
N$41
  Top 1: 23.72,47.75 C9.1 | 23.4,42.94 IC1.+VIN
  Top 1.2: L1.2 23.72,47.75
  Top 1.5: C9.1 23.4,47.7 23.4,42.94
NAV_B
  Top 1: U1.34/A15 57.51,78.26 60.38,81.13 78.89,81.13 85.67,74.35 91.8,74.35 97.66,68.48 97.66,63.88 100.24,61.3 S1.B1A
NAV_H  (via drill 0.6)
  Top 1: S1.H2 98,85.06 96.02,87.05 80.8,87.05 78.84,85.09 57.45,85.09 55.83,83.46 v52.98,83.46
  Bottom 1: v52.98,83.46 44.04,83.46 39.73,79.15 U1.A22
NAV_V  (via drill 0.6)
  Top 1: S1.V2 101.13,74 91.97,83.16 59.03,83.16 57.33,81.46 v52.93,81.46
  Bottom 1: v52.93,81.46 44.96,81.46 42.27,78.77 U1.A21
RST
  Top 1: J7.P$5 27.53,78.12 U1.16/A2
SCK0
  Top 0.356: 69.16,44.55 IC3.8
  Top 0.381: R3.1 71.25,46.63 69.16,44.55
SCK1  (via drill 0.7)
  Top 0.35: 48.62,76.25 48.62,78.94
  Top 1: v47.35,74.98 48.62,76.25 | 48.62,78.94 48.62,93.28 J7.P$14
  Bottom 1: U1.27 v47.35,74.98
SDA0
  Top 0.356: 68.68,45.21 IC3.9
  Top 0.381: R1.1 68.58,51.04 69.9,49.82 69.9,46.38 68.68,45.21
SYNC
  Top 0.356: IC3.7 69.77,43.92
  Top 0.381: 69.77,43.92 73.94,48.08 R2.1
TRIG1
  Top 0.6: IC2.7 9.14,50.04 10.67,51.56 10.67,54.81 9.22,56.26 9.22,62.35 U1.2
TRIG2
  Top 0.6: IC2.6 10.41,49.55 11.79,50.93 U1.3
VDD  (via drill 0.7)
  Top 0.356: IC3.24 60.58,40.01
  Top 0.381: 60.58,40.01 C8.1
  Top 0.8: C8.1 57.38,39.46 C7.1
  Top 1.2: IC5.3 34.87,25.65 v36.98,25.65 | v55.22,30.48 v55.22,39.12 57.24,39.12 C7.1
  Bottom 1.2: v36.98,25.65 45.85,25.65 50.67,30.48 v55.22,30.48
VSS  (via drill 0.7)
  Top 0.381: C6.1 70.33,40.01 IC3.1 64.52,40.01 64.39,40.03 | 64.39,43.46 IC3.25
  Top 0.762: 69.34,39.75 C6.1
  Top 1.016: C5.1 71.05,38.91 70.36,39.75 69.34,39.75
  Top 1.2: v74.14,38.71 73.91,38.94 71.87,38.94 | IC4.3 49.41,33.27 v47.83,33.27
  Top 1.27: 71.87,38.94 C5.1
  Top 2.032: 64.39,40.03 64.39,43.46
  Bottom 1.2: v47.83,33.27 v47.83,33.26 72.99,33.26 74.17,34.44 74.17,38.68 v74.14,38.71
  pour Top: 65.76,41.3 65.76,38.25 69.06,34.44 60.17,34.44 62.97,38.25 62.97,41.3

### Text on the board
tPlace: J7 | OLED Display | **Requires Display Mod: Jumper Option 1** | Teensy 4.1 | Thumb Joystick | * | * | * | Pulse Pal | * | * | * | rev3.0.4 | * | * | 3 | * | -12V | +12V | Open Source Pulse Train Generator